# EAGLE schematic Ir-Panel-Shield (EAGLE 7.2.0)
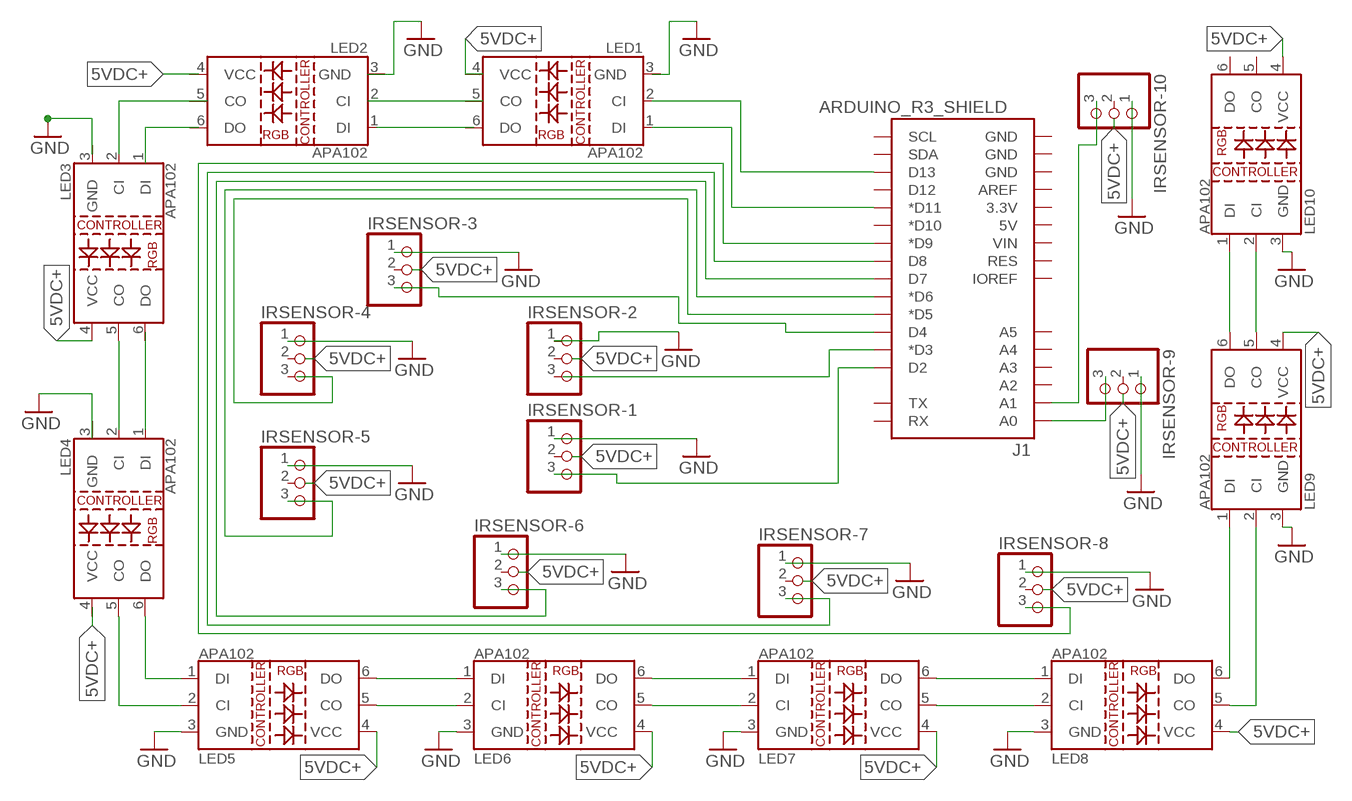
[diagram p0: schematic, sheet 1]

## Parts
IRSENSOR-1  PINHD-1X3  [1X03]
IRSENSOR-2  PINHD-1X3  [1X03]
IRSENSOR-3  PINHD-1X3  [1X03]
IRSENSOR-4  PINHD-1X3  [1X03]
IRSENSOR-5  PINHD-1X3  [1X03]
IRSENSOR-6  PINHD-1X3  [1X03]
IRSENSOR-7  PINHD-1X3  [1X03]
IRSENSOR-8  PINHD-1X3  [1X03]
IRSENSOR-9  PINHD-1X3  [1X03]
IRSENSOR-10  PINHD-1X3  [1X03]
J1  ARDUINO_R3_SHIELD  [UNO_R3_SHIELD]
LED1  LED-APA102  [LED-APA102]
LED2  LED-APA102  [LED-APA102]
LED3  LED-APA102  [LED-APA102]
LED4  LED-APA102  [LED-APA102]
LED5  LED-APA102  [LED-APA102]
LED6  LED-APA102  [LED-APA102]
LED7  LED-APA102  [LED-APA102]
LED8  LED-APA102  [LED-APA102]
LED9  LED-APA102  [LED-APA102]
LED10  LED-APA102  [LED-APA102]

## Nets
5VDC+: LED3.4(VCC) LED5.4(VCC) LED6.4(VCC) LED7.4(VCC) LED8.4(VCC) LED9.4(VCC) LED10.4(VCC)
GND: IRSENSOR-1.1 IRSENSOR-2.1 IRSENSOR-3.1 IRSENSOR-4.1 IRSENSOR-5.1 IRSENSOR-6.1 IRSENSOR-7.1 IRSENSOR-8.1 IRSENSOR-9.1 IRSENSOR-10.1 LED5.3(GND) LED6.3(GND) LED7.3(GND) LED8.3(GND) LED9.3(GND) LED10.3(GND)
N$1: J1.D13
N$2: J1.D11(*D11)
N$3: IRSENSOR-1.3 J1.D2
N$4: J1.D3(*D3)
N$7: IRSENSOR-3.3 J1.D4
N$8: IRSENSOR-5.3 J1.D6(*D6)
N$11: J1.D5(*D5)
N$13: LED3.5(CO)
N$14: IRSENSOR-6.3 J1.D7
N$15: LED4.5(CO) LED5.2(CI)
N$16: LED4.6(DO) LED5.1(DI)
N$17: LED5.6(DO) LED6.1(DI)
N$18: LED5.5(CO) LED6.2(CI)
N$19: LED6.6(DO) LED7.1(DI)
N$20: LED6.5(CO) LED7.2(CI)
N$21: LED7.6(DO) LED8.1(DI)
N$22: LED7.5(CO) LED8.2(CI)
N$23: LED8.6(DO) LED9.1(DI)
N$24: LED8.5(CO) LED9.2(CI)
N$25: LED9.6(DO) LED10.1(DI)
N$26: LED9.5(CO) LED10.2(CI)
N$27: IRSENSOR-7.3 J1.D8
N$28: IRSENSOR-9.3 J1.A0
N$29: IRSENSOR-8.3 J1.D9(*D9)
N$30: IRSENSOR-10.3 J1.A1
Unconnected: IRSENSOR-1.2 IRSENSOR-2.2 IRSENSOR-2.3 IRSENSOR-3.2 IRSENSOR-4.2 IRSENSOR-4.3 IRSENSOR-5.2 IRSENSOR-6.2 IRSENSOR-7.2 IRSENSOR-8.2 IRSENSOR-9.2 IRSENSOR-10.2 J1.3.3V J1.5V J1.A2 J1.A3 J1.A4 J1.A5 J1.AREF J1.D10(*D10) J1.D12 J1.GND@0(GND) J1.GND@1(GND) J1.GND@2(GND) J1.IOREF J1.RES J1.RX J1.SCL J1.SDA J1.TX J1.VIN LED1.1(DI) LED1.2(CI) LED1.3(GND) LED1.4(VCC) LED1.5(CO) LED1.6(DO) LED2.1(DI) LED2.2(CI) LED2.3(GND) LED2.4(VCC) LED2.5(CO) LED2.6(DO) LED3.1(DI) LED3.2(CI) LED3.3(GND) LED3.6(DO) LED4.1(DI) LED4.2(CI) LED4.3(GND) LED4.4(VCC) LED10.5(CO) LED10.6(DO)

## Library data of the parts
IRSENSOR-1-IRSENSOR-10 = pinhead:PINHD-1X3: PIN HEADER
J1 = SparkFun-Boards:ARDUINO_R3_SHIELD: Shield form compatible with the Arduino Uno R3.
LED1-LED10 = Ai_LED:LED-APA102